# Altium schematic sheet Connectors.SchDoc
size A; SheetNumber: 23; SheetTotal: 24
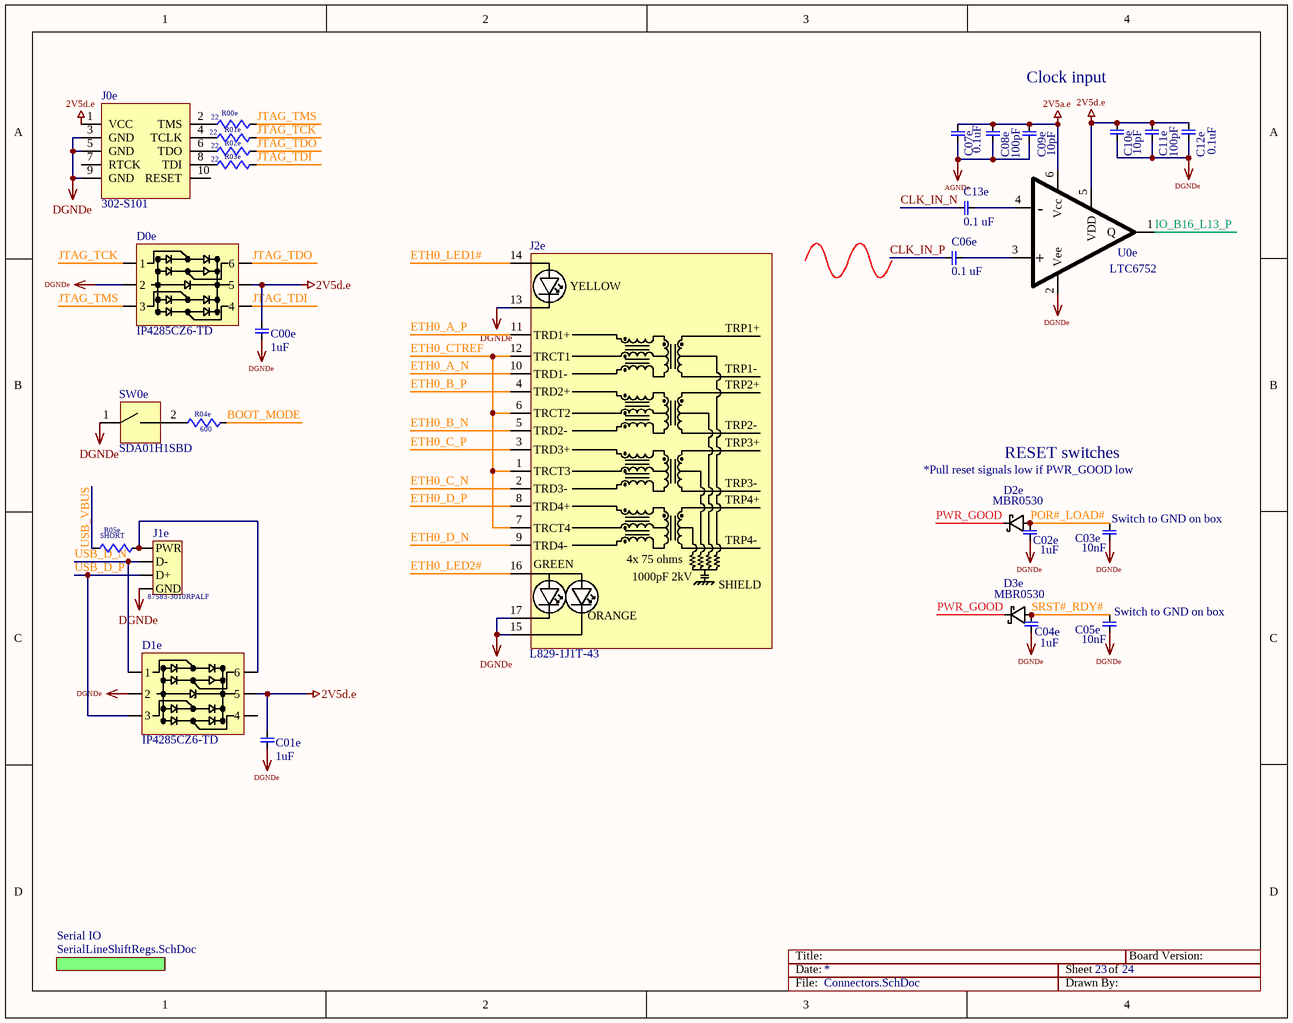
[diagram p0: Connectors.SchDoc]

## Parts
C00e  1uF  [0603]
C01e  1uF  [0603]
C02e  1uF  [0603]
C03e  10nF  [0603]
C04e  1uF  [0603]
C05e  10nF  [0603]
C06e  0.1 uF  [0805]
C07e  0.1uF  [0603]
C08e  100pF  [0603]
C09e  10pF  [0603]
C10e  10pF  [0603]
C11e  100pF  [0603]
C12e  0.1uF  [0603]
C13e  0.1 uF  [0805]
D0e  IP4285CZ6-TD  [6-TSOP]
D1e  IP4285CZ6-TD  [6-TSOP]
D2e  MBR0530  [SOD123]
D3e  MBR0530  [SOD123]
J0e  302-S101  [3020-10-0300-00]
J1e  87583-3010RPALF  [87583-3010RPALF]
J2e  L829-1J1T-43  [L829-1J1T-43]
R00e  22  [0603]
R01e  22  [0603]
R02e  22  [0603]
R03e  22  [0603]
R04e  600  [0603]
R05e  SHORT  [0603]
SW0e  SDA01H1SBD  [SDA01H1SBD]
U0e  LTC6752  [sc70]

## Sub-sheets
Serial IO = SerialLineShiftRegs.SchDoc: no entries

## Nets
2V5a.e: C07e.1 C08e.1 C09e.1 U0e.6(Vcc)
2V5d.e: C00e.1 C01e.1 C10e.1 C11e.1 C12e.1 D0e.5 D1e.5 J0e.1(VCC) U0e.5(VDD)
AGNDe: C07e.2 C08e.2 C09e.2
DGNDe: C00e.2 C01e.2 C02e.2 C03e.2 C04e.2 C05e.2 C10e.2 C11e.2 C12e.2 D0e.2 D1e.2 J0e.3(GND) J0e.5(GND) J0e.9(GND) J1e.GND J2e.13 J2e.15 J2e.17 SW0e.1 U0e.2(Vee)
BOOT_MODE: R04e.2
CLK_IN_N: C13e.1
CLK_IN_P: C06e.1
ETH0_A_N: J2e.10(TRD1-)
ETH0_A_P: J2e.11(TRD1+)
ETH0_B_N: J2e.5(TRD2-)
ETH0_B_P: J2e.4(TRD2+)
ETH0_C_N: J2e.2(TRD3-)
ETH0_C_P: J2e.3(TRD3+)
ETH0_CTREF: J2e.1(TRCT3) J2e.6(TRCT2) J2e.7(TRCT4) J2e.12(TRCT1)
ETH0_D_N: J2e.9(TRD4-)
ETH0_D_P: J2e.8(TRD4+)
ETH0_LED1#: J2e.14
ETH0_LED2#: J2e.16
IO_B16_L13_P: U0e.1(Q)
JTAG_TCK: D0e.1 R01e.2
JTAG_TDI: D0e.4 R03e.2
JTAG_TDO: D0e.6 R02e.2
JTAG_TMS: D0e.3 R00e.1
POR#_LOAD#: C02e.1 C03e.1 D2e.2
PWR_GOOD: D2e.1 D3e.1
SRST#_RDY#: C04e.1 C05e.1 D3e.2
USB_D_N: D1e.1 J1e.D-
USB_D_P: D1e.3 J1e.D+
USB_VBUS: R05e.1
NetC06e_2: C06e.2 U0e.3(+)
NetC13e_2: C13e.2 U0e.4(-)
NetD1e_6: D1e.6 J1e.PWR R05e.2
NetJ0e_2: J0e.2(TMS) R00e.2
NetJ0e_4: J0e.4(TCLK) R01e.1
NetJ0e_6: J0e.6(TDO) R02e.1
NetJ0e_8: J0e.8(TDI) R03e.1
NetR04e_1: R04e.1 SW0e.2

Not connected (* = marked no-connect by the designer): D1e 4; J0e 7(RTCK) 10(RESET)

## Notes on the sheet
- Clock input
- *Pull reset signals low if PWR_GOOD low
- RESET switches
- (near C03e) Switch to GND on box
- (near C05e) Switch to GND on box
- Title:
- Date:
- Sheet
- of
- Board Version:
- File:
- Drawn By:
- (in symbol L829-1J1T-43) YELLOW; TRP1+; TRP1-; TRP2+; TRP2-; TRP3+; TRP3-; TRP4+; TRP4-; 4x 75 ohms; GREEN; 1000pF 2kV; SHIELD; ORANGE

## Library data of the parts
C00e C01e C02e C03e C04e C05e C06e C07e C08e C09e C10e C11e C12e C13e = CAP
D2e D3e = Schottky_Diode
J0e = JTAG_10: JTAG Connector
R00e R01e R02e R03e R04e R05e = RES
SW0e = SW1